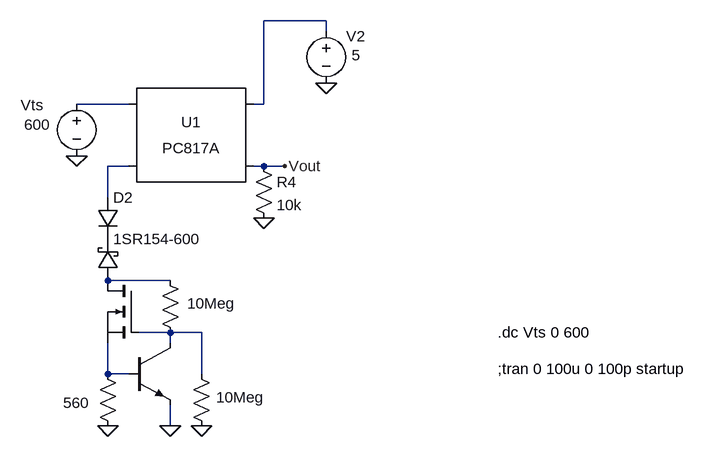
[diagram p0: schematic hv-detect.asc]
hv-detect.asc, the LTspice schematic file:
Version 4
SHEET 1 1128 680
WIRE 432 -336 336 -336
WIRE 432 -320 432 -336
WIRE 128 -208 48 -208
WIRE 336 -208 336 -336
WIRE 336 -208 320 -208
WIRE 128 -112 96 -112
WIRE 336 -112 320 -112
WIRE 368 -112 336 -112
WIRE 96 -64 96 -112
WIRE 192 64 96 64
WIRE 192 144 144 144
WIRE 240 144 192 144
WIRE 192 160 192 144
WIRE 96 208 96 160
WIRE 128 208 96 208
WIRE 240 208 240 144
WIRE 192 288 192 256
FLAG 192 288 0
FLAG 96 288 0
FLAG 48 -128 0
FLAG 336 -32 0
FLAG 432 -240 0
FLAG 368 -112 Vout
FLAG 240 288 0
SYMBOL npn 128 160 R0
WINDOW 0 -325 88 Invisible 2
WINDOW 3 375 248 Invisible 2
SYMATTR InstName Q1
SYMATTR Value BC848B
SYMBOL res 80 192 R0
WINDOW 0 285 294 Invisible 2
WINDOW 3 -53 60 Left 2
SYMATTR InstName R1
SYMATTR Value 560
SYMBOL nmos 144 64 M0
WINDOW 0 337 -4 Invisible 2
WINDOW 3 341 123 Invisible 2
SYMATTR InstName M1
SYMATTR Value STW11NM80
SYMBOL res 176 48 R0
WINDOW 0 389 60 Invisible 2
WINDOW 3 42 51 Left 2
SYMATTR InstName R2
SYMATTR Value 10Meg
SYMBOL voltage 48 -224 R0
WINDOW 0 -86 18 Left 2
WINDOW 3 -81 48 Left 2
WINDOW 123 0 0 Left 0
SYMATTR InstName Vts
SYMATTR Value 600
SYMATTR SpiceLine Rser=1m
SYMBOL schottky 112 64 R180
WINDOW 0 237 55 Invisible 2
WINDOW 3 284 101 Invisible 2
SYMATTR InstName D1
SYMATTR Value RBQ10T45A
SYMATTR Description Zener Diode
SYMATTR Type zener
SYMBOL res 224 192 R0
WINDOW 0 385 -24 Invisible 2
WINDOW 3 39 52 Left 2
SYMATTR InstName R3
SYMATTR Value 10Meg
SYMBOL Optos\\PC817A 224 -160 R0
SYMATTR InstName U1
SYMBOL diode 80 -64 R0
SYMATTR InstName D2
SYMATTR Value 1SR154-600
SYMBOL res 320 -128 R0
SYMATTR InstName R4
SYMATTR Value 10k
SYMBOL voltage 432 -336 R0
WINDOW 0 31 24 Left 2
WINDOW 3 39 53 Left 2
WINDOW 123 0 0 Left 0
WINDOW 39 0 0 Left 0
SYMATTR InstName V2
SYMATTR Value 5
TEXT 696 200 Left 2 !;tran 0 100u 0 100p startup
TEXT 696 144 Left 2 !.dc Vts 0 600

The netlist it stands for:
* hv-detect.asc
Q1 N005 N006 0 0 BC848B
R1 N006 0 560
M1 N004 N005 N006 N006 STW11NM80
R2 N004 N005 10Meg
Vts N002 0 600 Rser=1m
D1 N004 P001 RBQ10T45A
R3 N005 0 10Meg
XU1 N002 N003 N001 Vout PC817 Igain=1m
D2 N003 P001 1SR154-600
R4 Vout 0 10k
V2 N001 0 5
.model D D
.lib standard.dio
.model NPN NPN
.model PNP PNP
.lib standard.bjt
.model NMOS NMOS
.model PMOS PMOS
.lib standard.mos
;tran 0 100u 0 100p startup
.dc Vts 0 600
.lib PC817.sub
.backanno
.end